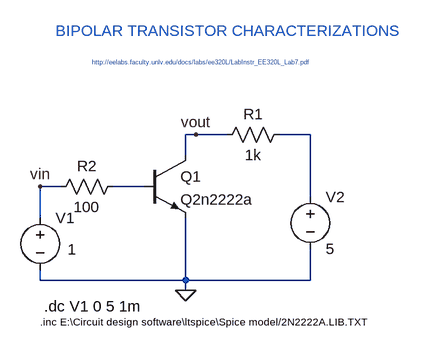
[diagram p0: schematic BJT_DC_sweep.asc]
BJT_DC_sweep.asc, the LTspice schematic file:
Version 4
SHEET 1 880 680
WIRE 208 80 192 80
WIRE 256 80 208 80
WIRE 384 80 336 80
WIRE 192 112 192 80
WIRE 0 160 -32 160
WIRE 128 160 80 160
WIRE 384 176 384 80
WIRE -32 208 -32 160
WIRE -32 304 -32 288
WIRE 192 304 192 208
WIRE 192 304 -32 304
WIRE 384 304 384 256
WIRE 384 304 192 304
WIRE 192 320 192 304
FLAG 192 320 0
FLAG -32 160 vin
FLAG 208 80 vout
SYMBOL npn3 128 112 R0
SYMATTR InstName Q1
SYMATTR Value Q2n2222a
SYMBOL res 352 64 R90
WINDOW 0 0 56 VBottom 2
WINDOW 3 32 56 VTop 2
SYMATTR InstName R1
SYMATTR Value 1k
SYMBOL res 96 144 R90
WINDOW 0 0 56 VBottom 2
WINDOW 3 32 56 VTop 2
SYMATTR InstName R2
SYMATTR Value 100
SYMBOL voltage -32 192 R0
WINDOW 3 42 65 Left 2
WINDOW 123 0 0 Left 0
WINDOW 39 0 0 Left 0
SYMATTR InstName V1
SYMATTR Value 1
SYMBOL voltage 384 160 R0
WINDOW 123 0 0 Left 0
WINDOW 39 0 0 Left 0
SYMATTR InstName V2
SYMATTR Value 5
TEXT -32 368 Left 1 !.inc E:\\Circuit design software\\ltspice\\Spice model/2N2222A.LIB.TXT
TEXT -26 344 Left 2 !.dc V1 0 5 1m
TEXT -8 -80 Left 2 ;BIPOLAR TRANSISTOR CHARACTERIZATIONS
TEXT 48 -32 Left 0 ;http://eelabs.faculty.unlv.edu/docs/labs/ee320L/LabInstr_EE320L_Lab7.pdf

The netlist it stands for:
* BJT_DC_sweep.asc
Q1 vout N002 0 0 Q2n2222a
R1 N001 vout 1k
R2 N002 vin 100
V1 vin 0 1
V2 N001 0 5
.model NPN NPN
.model PNP PNP
.lib standard.bjt
.inc E:\Circuit design software\ltspice\Spice model/2N2222A.LIB.TXT
.dc V1 0 5 1m
* BIPOLAR TRANSISTOR CHARACTERIZATIONS
* http://eelabs.faculty.unlv.edu/docs/labs/ee320L/LabInstr_EE320L_Lab7.pdf
.backanno
.end

* Results of the author's LTspice run, read from the files saved beside the schematic
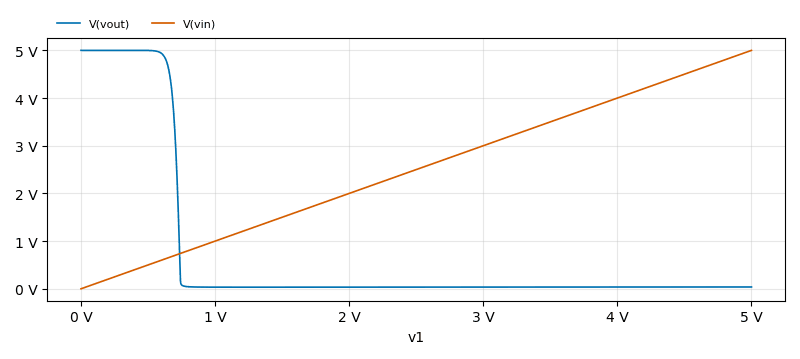
[diagram p1: DC transfer characteristic of BJT_DC_sweep.asc, plotted from the saved traces]
* DC transfer characteristic, 1 run:
*   V(vout): 5 V at v1=0 V, 38.1 mV at v1=5 V, min 33.85 mV, max 5 V
*   V(vin): 0 V at v1=0 V, 5 V at v1=5 V, min 0 V, max 5 V